# EasyEDA Pro project MN42_v2.eprj, schematic MOAR_Schematic, sheet 4 of 4

## Sheets
4 brain: Create Date: 2026-02-03; Page Name: brain; Update Date: 2026-02-02
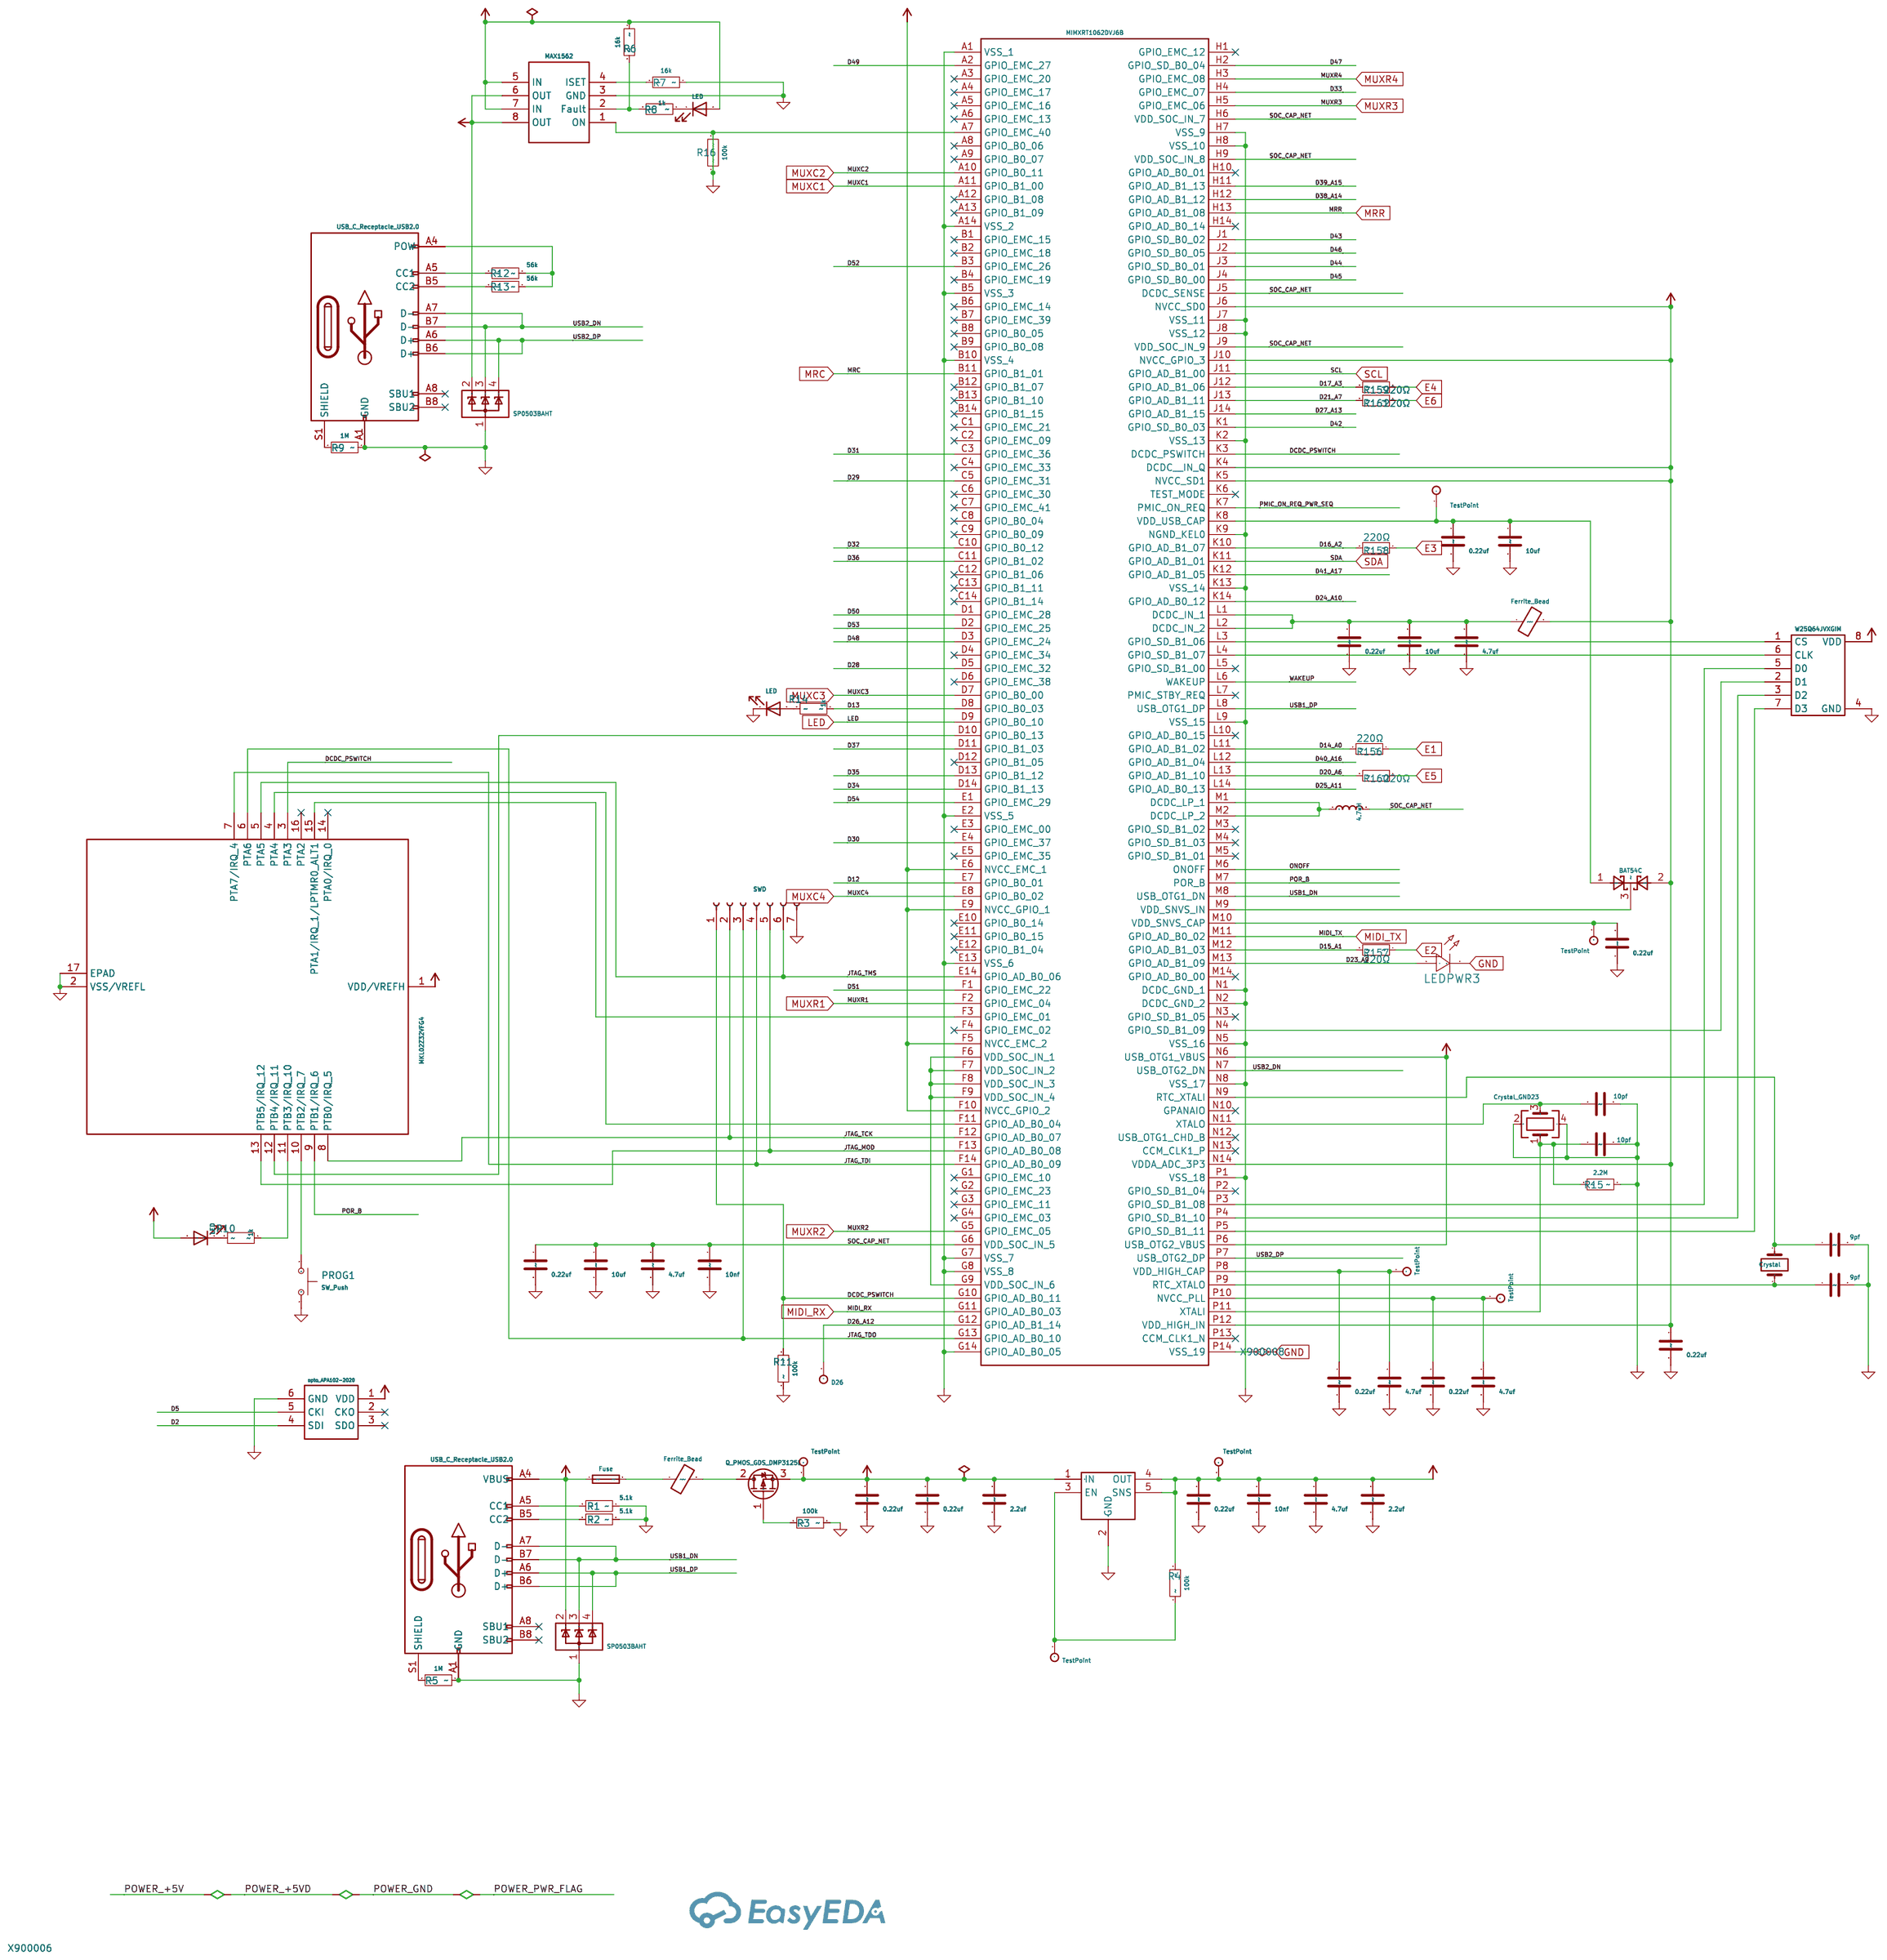
[diagram p3: brain]

## Parts
C1  0.22uf  [Capacitor_SMD:C_0603_1608Metric]
C2  0.22uf  [Capacitor_SMD:C_0603_1608Metric]
C3  2.2uf  [Capacitor_SMD:C_0603_1608Metric]
C4  0.22uf  [Capacitor_SMD:C_0603_1608Metric]
C10  0.22uf  [Capacitor_SMD:C_0603_1608Metric]
C11  10uf  [Capacitor_SMD:C_0805_2012Metric]
C12  4.7uf  [Capacitor_SMD:C_0603_1608Metric]
C13  0.22uf  [Capacitor_SMD:C_0603_1608Metric]
C14  10uf  [Capacitor_SMD:C_0805_2012Metric]
C15  4.7uf  [Capacitor_SMD:C_0603_1608Metric]
C16  10nf  [Capacitor_SMD:C_0603_1608Metric]
C17  0.22uf  [Capacitor_SMD:C_0603_1608Metric]
C18  0.22uf  [Capacitor_SMD:C_0603_1608Metric]
C19  10pf  [Capacitor_SMD:C_0603_1608Metric]
C20  10pf  [Capacitor_SMD:C_0603_1608Metric]
C21  9pf  [Capacitor_SMD:C_0603_1608Metric]
C22  9pf  [Capacitor_SMD:C_0603_1608Metric]
C23  0.22uf  [Capacitor_SMD:C_0603_1608Metric]
C24  4.7uf  [Capacitor_SMD:C_0603_1608Metric]
C25  0.22uf  [Capacitor_SMD:C_0603_1608Metric]
C26  4.7uf  [Capacitor_SMD:C_0603_1608Metric]
C138  2.2uf  [Capacitor_SMD:C_0603_1608Metric]
C139  0.22uf  [Capacitor_SMD:C_0603_1608Metric]
C140  4.7uf  [Capacitor_SMD:C_0603_1608Metric]
C141  10uf  [Capacitor_SMD:C_0805_2012Metric]
C142  10nf  [Capacitor_SMD:C_0603_1608Metric]
D1  SP0503BAHT  [Package_TO_SOT_SMD:SOT-143]
D2  LED  [LED_SMD:LED_0402_1005Metric]
D3  LED  [LED_SMD:LED_0402_1005Metric]
D4  LED  [LED_SMD:LED_0402_1005Metric]
D5  BAT54C  [Package_TO_SOT_SMD:SOT-23]
Di3  SP0503BAHT  [Package_TO_SOT_SMD:SOT-143]
F2  Fuse  [Resistor_SMD:R_0805_2012Metric]
FB1  Ferrite_Bead  [Resistor_SMD:R_0805_2012Metric]
FB2  Ferrite_Bead  [Resistor_SMD:R_0805_2012Metric]
IC1  MIMXRT1062DVJ6B  [MIMXRT1062DVJ6B:BGA196C80P14X14_1200X1200X152]
L1  4.7uH  [Capacitor_SMD:C_0805_2012Metric]
LEDPWR3  -  [LED_0603]
NCP692  OnSemi NCP692, fixed version  [Package_DFN_QFN:DFN-6-1EP_3x3mm_P0.95mm_EP1.7x2.6mm]
P2  D26  [Connector_PinHeader_1.00mm:PinHeader_1x01_P1.00mm_Vertical]
PROG1  SW_Push  [ToyTronics:KMR241GLFS]
Q1  Q_PMOS_GDS_DMP3125L  [Package_TO_SOT_SMD:SOT-23]
R1  5.1k  [Resistor_SMD:R_0603_1608Metric]
R2  5.1k  [Resistor_SMD:R_0603_1608Metric]
R3  100k  [Resistor_SMD:R_0603_1608Metric]
R4  100k  [Resistor_SMD:R_0603_1608Metric]
R5  1M  [Resistor_SMD:R_0603_1608Metric]
R6  16k  [Resistor_SMD:R_0603_1608Metric]
R7  16k  [Resistor_SMD:R_0603_1608Metric]
R8  1k  [Resistor_SMD:R_0402_1005Metric]
R9  1M  [Resistor_SMD:R_0603_1608Metric]
R10  1k  [Resistor_SMD:R_0402_1005Metric]
R11  100k  [Resistor_SMD:R_0603_1608Metric]
R12  56k  [Resistor_SMD:R_0603_1608Metric]
R13  56k  [Resistor_SMD:R_0603_1608Metric]
R14  1k  [Resistor_SMD:R_0402_1005Metric]
R15  2.2M  [Resistor_SMD:R_0603_1608Metric]
R16  100k  [Resistor_SMD:R_0603_1608Metric]
R156  220Ω  [RES-TH_BD1.7-L3.5-P7.50-D0.5]
R157  220Ω  [RES-TH_BD1.7-L3.5-P7.50-D0.5]
R158  220Ω  [RES-TH_BD1.7-L3.5-P7.50-D0.5]
R159  220Ω  [RES-TH_BD1.7-L3.5-P7.50-D0.5]
R160  220Ω  [RES-TH_BD1.7-L3.5-P7.50-D0.5]
R161  220Ω  [RES-TH_BD1.7-L3.5-P7.50-D0.5]
SWD1  SWD  [Connector_PinHeader_1.27mm:PinHeader_1x07_P1.27mm_Vertical]
TP1  TestPoint  [TestPoint:TestPoint_Pad_D1.0mm]
TP2  TestPoint  [TestPoint:TestPoint_Pad_D1.0mm]
TP3  TestPoint  [TestPoint:TestPoint_Pad_D1.0mm]
TP4  TestPoint  [TestPoint:TestPoint_Pad_D1.0mm]
TP5  TestPoint  [TestPoint:TestPoint_Pad_D1.0mm]
TP6  TestPoint  [TestPoint:TestPoint_Pad_D1.0mm]
TP7  TestPoint  [TestPoint:TestPoint_Pad_D1.0mm]
U1  opto_APA102-2020  [USB-C-Power-tester:APA102-2020]
U2  MAX1562  [Package_SO:SO-8_3.9x4.9mm_P1.27mm]
U3  W25Q64JVXGIM  [MIMXRT1062DVJ6B:XSON8_4x4mm]
U4  MKL02Z32VFG4  [Package_DFN_QFN:QFN-16-1EP_3x3mm_P0.5mm_EP1.8x1.8mm]
USB_DFP1  USB_C_Receptacle_USB2.0  [USB-C-Power-tester:TYPE-C-31-M-14]
USB_UFP1  USB_C_Receptacle_USB2.0  [USB-C-Power-tester:TYPE-C-31-M-14]
Y1  Crystal_GND23  [Crystal:Crystal_SMD_Abracon_ABM3B-4Pin_5.0x3.2mm]
Y2  Crystal  [Crystal:Crystal_SMD_2012-2Pin_2.0x1.2mm]

## Library data of the parts
C1 C2 C4 C10 C13 C17 C18 C23 C25 C139 = Device_C: Attribute1: C3; MFGR: Jellybean (X7R or better); MPN: CC0603KRX7R6BB224
C3 = Device_C: MFGR: Jellybean (X7R or better); MPN: CL10B225KP8NNNC
C11 C14 C141 = Device_C: MFGR: Jellybean (X7R or better); MPN: GRM21BR71A106KA73K
C12 C15 C24 C26 C140 = Device_C: Attribute1: C3; MFGR: Jellybean (X7R or better); MPN: CL10B475KQ8NQNC
C16 C142 = Device_C: Attribute1: C3; MFGR: Jellybean (X7R or better); MPN: 0603B103K160CT
C19 C20 = Device_C: Attribute1: C3; MFGR: Jellybean (X7R or better); MPN: CC0603KRNPO9BN100
C21 C22 = Device_C: Attribute1: C3; MFGR: Jellybean (X7R or better); MPN: GRM1885C1H9R0DA01D
C138 = Device_C: Attribute1: C3; MFGR: Jellybean (X7R or better); MPN: CL10B225KP8NNNC
D1 = Power_Protection_SP0503BAHT: Attribute1: Di3; User doc link: http://www.littelfuse.com/~/media/files/littelfuse/technical%20resources/documents/data%20sheets/sp05xxba.pdf
D2 = Device_LED
D3 D4 = Device_LED: Attribute1: D2
D5 = Diode_BAT54C: User doc link: http://www.diodes.com/_files/datasheets/ds11005.pdf
Di3 = Power_Protection_SP0503BAHT: User doc link: http://www.littelfuse.com/~/media/files/littelfuse/technical%20resources/documents/data%20sheets/sp05xxba.pdf
F2 = Device_Fuse: MFGR: Bel Fuse Inc; MPN: 0ZCK0050FF2E
FB1 FB2 = Device_Ferrite_Bead: Attribute1: F1; MFGR: Taiyo Yuden; MPN: FBMH2012HM121-T‎
IC1 = MIMXRT1062DVJ6B_MIMXRT1062DVJ6B: IC MCU 32BIT EXT MEM 196MAPBGA; Height: 1.52; Manufacturer_Name: NXP; Mouser Part Number: 771-MIMXRT1062DVJ6B; Mouser Price/Stock: https://www.mouser.co.uk/ProductDetail/NXP-Semiconductors/MIMXRT1062DVJ6B?qs=BJlw7L4Cy7%252B08A9rbTO5WQ%3D%3D; User doc link: https://www.nxp.com/docs/en/nxp/data-sheets/IMXRT1060CEC.pdf
L1 = Device_L: Attribute1: C14; MFGR: Jellybean (X7R or better); MPN: LQM21PN4R7MGRD
LEDPWR3 = LED_0603-R: Supplier Footprint: 0603
NCP692 = ToyTronics2_OnSemi NCP692, fixed version: MFGR: Onsemi; MPN: NCP692MN33T2G; User doc link: https://www.onsemi.com/pdf/datasheet/ncp690-d.pdf
P2 TP7 = Connector_TestPoint
PROG1 = Switch_SW_Push: Attribute1: *; Attribute2: Copyright 2016 Accelerated Designs. All rights reserved.; Attribute3: *; MFGR: C&K; MPN: KMR241GLFS
Q1 = Device_Q_PMOS_GDS: Attribute1: DMP3125L; Attribute2: Diodes; User doc link: https://www.diodes.com/assets/Datasheets/DMP3125L.pdf
R1 R2 = Device_R: Attribute1: R7; MFGR: Jellybean; MPN: RC0603FR-075K1L
R3-R6 R9 R11-R13 R15 R16 = Device_R: Attribute1: R7; MFGR: Jellybean; MPN: RMCF0603FT56K0
R7 = Device_R: MFGR: Jellybean; MPN: RMCF0603FT56K0
R8 R10 = Device_R: Attribute1: R14
R14 = Device_R
R156-R161 = RN 1/8W 4K7 F T/B A1: Type:Metal Film Resistors Resistance: Tolerance:±1% Tolerance:±1% Overload Voltage (Max):150V Power(Watts):125mW Temperature Coefficient:±50ppm/℃ Temperature Coefficient:±50ppm/℃ Operating Temperature Range:-55℃~+125℃ Operating Temperature Range:-55℃~+125; LCSC Part Name: 4.7kΩ ±1% 125mW 金属膜电阻; Supplier Part: C433477; Manufacturer: Tyohm(幸亚电阻); Supplier Footprint: 插件,D1.7xL3.5mm; JLCPCB Part Class: Extended Part; Datasheet: https://atta.szlcsc.com/upload/public/pdf/source/20191008/C433681_B72693A7FD256E0D1DC5EFE3F095EED3.pdf; Supplier: LCSC; Type: Metal Film Resistors; Tolerance: ±1%; Overload Voltage (Max): 150V; Power(Watts): 125mW; Temperature Coefficient: ±50ppm/℃; Operating Temperature Range: -55℃~+125℃
SWD1 = Connector_Conn_01x07_Female
TP1-TP6 = Connector_TestPoint: Attribute1: TP7
U1 = APA102_opto_APA102-2020
U2 = MIMXRT1062DVJ6B_MAX1562
U3 = MIMXRT1062DVJ6B_W25Q64VXGIM
U4 = MCU_NXP_Kinetis_MKL02Z32VFG4: MFGR: Supplied by Roest Coffee; MPN: Custom firmware part; User doc link: http://www.nxp.com/docs/en/data-sheet/KL02P32M48SF0.pdf
USB_DFP1 = simonsen_USB_C_Receptacle_USB2.0_NOPOW: User doc link: https://www.usb.org/sites/default/files/documents/usb_type-c.zip
USB_UFP1 = Connector_USB_C_Receptacle_USB2.0: User doc link: https://www.usb.org/sites/default/files/documents/usb_type-c.zip
Y1 = Device_Crystal_GND24
Y2 = Device_Crystal: MFGR: Abracon; MPN: ABS06-32.768KHZ-9-1-T

## Nets
GND: C1.1 C1.2 C2.1 C2.2 C3.1 C3.2 C4.2 C10.2 C11.2 C12.2 C13.2 C14.2 C15.2 C16.2 C17.2 C18.2 C19.2 C20.2 C21.2 C22.2 C23.2 C24.2 C25.2 C26.2 C138.2 C139.2 C140.2 C141.2 C142.2 D1.1(A) D1.2(K) D2.2(A) D3.1(K) Di3.1(A) F2.1 IC1.A1(VSS_1) IC1.A7(GPIO_EMC_40) IC1.A14(VSS_2) IC1.B5(VSS_3) IC1.B10(VSS_4) IC1.E2(VSS_5) IC1.E13(VSS_6) IC1.G7(VSS_7) IC1.G8(VSS_8) IC1.G14(GPIO_AD_B0_05) IC1.H7(VSS_9) IC1.H8(VSS_10) IC1.J7(VSS_11) IC1.J8(VSS_12) IC1.K2(VSS_13) IC1.K9(NGND_KEL0) IC1.K13(VSS_14) IC1.L9(VSS_15) IC1.N1(DCDC_GND_1) IC1.N2(DCDC_GND_2) IC1.N5(VSS_16) IC1.N6(USB_OTG1_VBUS) IC1.N8(VSS_17) IC1.P1(VSS_18) IC1.P6(USB_OTG2_VBUS) IC1.P14(VSS_19) LEDPWR3.1(C) NCP692.1(IN) NCP692.2(GND) NCP692.6(IN) NCP692.7(GND) PROG1.2 Q1.3(S) R1.1 R2.1 R3.1 R5.1 R6.1 R7.1 R9.1 R11.1 R15.1 R16.1 R16.2 SWD1.7(Pin) TP1.1 U1.1(VDD) U1.6(GND) U2.1(ON) U2.3(GND) U2.5(IN) U2.7(IN) U3.4(GND) U4.2(VSS/VREFL) U4.17(EPAD) USB_DFP1.A1(GND) USB_DFP1.A12(GND) USB_DFP1.B1(GND) USB_DFP1.B12(GND) USB_UFP1.A1(GND) USB_UFP1.A4(VBUS) USB_UFP1.A9(VBUS) USB_UFP1.A12(GND) USB_UFP1.B1(GND) USB_UFP1.B4(VBUS) USB_UFP1.B9(VBUS) USB_UFP1.B12(GND) Y1.2 Y1.4 ; also on sheet 1 2 3
D2: U1.4(SDI)
D5: U1.5(CKI)
D12: IC1.E7(GPIO_B0_01)
D13: IC1.D8(GPIO_B0_03) R14.1
D14_A0: IC1.L11(GPIO_AD_B1_02) R156.2
D15_A1: IC1.M12(GPIO_AD_B1_03) R157.2
D16_A2: IC1.K10(GPIO_AD_B1_07) R158.2
D17_A3: IC1.J12(GPIO_AD_B1_06) R159.2
D20_A6: IC1.L13(GPIO_AD_B1_10) R160.2
D21_A7: IC1.J13(GPIO_AD_B1_11) R161.2
D23_A9: IC1.M13(GPIO_AD_B1_09) LEDPWR3.2(A)
D24_A10: IC1.K14(GPIO_AD_B0_12)
D25_A11: IC1.L14(GPIO_AD_B0_13)
D26_A12: IC1.G12(GPIO_AD_B1_14) P2.1
D27_A13: IC1.J14(GPIO_AD_B1_15)
D28: IC1.D5(GPIO_EMC_32)
D29: IC1.C5(GPIO_EMC_31)
D30: IC1.E4(GPIO_EMC_37)
D31: IC1.C3(GPIO_EMC_36)
D32: IC1.C10(GPIO_B0_12)
D33: IC1.H4(GPIO_EMC_07)
D34: IC1.D14(GPIO_B1_13)
D35: IC1.D13(GPIO_B1_12)
D36: IC1.C11(GPIO_B1_02)
D37: IC1.D11(GPIO_B1_03)
D38_A14: IC1.H12(GPIO_AD_B1_12)
D39_A15: IC1.H11(GPIO_AD_B1_13)
D40_A16: IC1.L12(GPIO_AD_B1_04)
D41_A17: IC1.K12(GPIO_AD_B1_05)
D42: IC1.K1(GPIO_SD_B0_03)
D43: IC1.J1(GPIO_SD_B0_02)
D44: IC1.J3(GPIO_SD_B0_01)
D45: IC1.J4(GPIO_SD_B0_00)
D46: IC1.J2(GPIO_SD_B0_05)
D47: IC1.H2(GPIO_SD_B0_04)
D48: IC1.D3(GPIO_EMC_24)
D49: IC1.A2(GPIO_EMC_27)
D50: IC1.D1(GPIO_EMC_28)
D51: IC1.F1(GPIO_EMC_22)
D52: IC1.B3(GPIO_EMC_26)
D53: IC1.D2(GPIO_EMC_25)
D54: IC1.E1(GPIO_EMC_29)
DCDC_PSWITCH: IC1.G10(GPIO_AD_B0_11) IC1.K3(DCDC_PSWITCH) R11.2 SWD1.1(Pin) U4.3(PTA3)
E1: R156.1 ; also on sheet 3
E2: R157.1 ; also on sheet 3
E3: R158.1 ; also on sheet 3
E4: R159.1 ; also on sheet 3
E5: R160.1 ; also on sheet 3
E6: R161.1 ; also on sheet 3
JTAG_MOD: IC1.F13(GPIO_AD_B0_08) SWD1.5(Pin) U4.13(PTB5/IRQ_12)
JTAG_TCK: IC1.F12(GPIO_AD_B0_07) SWD1.2(Pin) U4.8(PTB0/IRQ_5)
JTAG_TDI: IC1.F14(GPIO_AD_B0_09) SWD1.4(Pin) U4.7(PTA7/IRQ_4)
JTAG_TDO: IC1.G13(GPIO_AD_B0_10) SWD1.3(Pin) U4.6(PTA6)
JTAG_TMS: IC1.E14(GPIO_AD_B0_06) SWD1.6(Pin) U4.5(PTA5)
LED: IC1.D9(GPIO_B0_10) ; also on sheet 1
MIDI_RX: IC1.G11(GPIO_AD_B0_03) ; also on sheet 2
MIDI_TX: IC1.M11(GPIO_AD_B0_02) ; also on sheet 1
MRC: IC1.B11(GPIO_B1_01) ; also on sheet 2
MRR: IC1.H13(GPIO_AD_B1_08) ; also on sheet 2
MUXC1: IC1.A11(GPIO_B1_00) ; also on sheet 2
MUXC2: IC1.A10(GPIO_B0_11) ; also on sheet 2
MUXC3: IC1.D7(GPIO_B0_00) ; also on sheet 2
MUXC4: IC1.E8(GPIO_B0_02) ; also on sheet 2
MUXR1: IC1.F2(GPIO_EMC_04) ; also on sheet 2
MUXR2: IC1.G5(GPIO_EMC_05) ; also on sheet 2
MUXR3: IC1.H5(GPIO_EMC_06) ; also on sheet 2
MUXR4: IC1.H3(GPIO_EMC_08) ; also on sheet 2
ONOFF: IC1.M6(ONOFF)
PMIC_ON_REQ_PWR_SEQ: IC1.K7(PMIC_ON_REQ)
POR_B: IC1.M7(POR_B) U4.9(PTB1/IRQ_6)
POWER_+3V3: C4.1 C17.1 C138.1 C140.1 C142.1 D4.2(A) D5.2 FB2.2 IC1.E6(NVCC_EMC_1) IC1.E9(NVCC_GPIO_1) IC1.F5(NVCC_EMC_2) IC1.F10(NVCC_GPIO_2) IC1.J6(NVCC_SD0) IC1.J10(NVCC_GPIO_3) IC1.K4(DCDC__IN_Q) IC1.K5(NVCC_SD1) IC1.N14(VDDA_ADC_3P3) IC1.P12(VDD_HIGH_IN) NCP692.4(OUT) NCP692.5(SNS) R4.2 TP2.1 U3.8(VDD) U4.1(VDD/VREFH)
POWER_+5VL: Di3.2(K) R12.1 R13.1 U2.6(OUT) U2.8(OUT) USB_DFP1.A4(POW) USB_DFP1.A9(POW) USB_DFP1.B4(POW) USB_DFP1.B9(POW)
SCL: IC1.J11(GPIO_AD_B1_00) ; also on sheet 2
SDA: IC1.K11(GPIO_AD_B1_01) ; also on sheet 2
SOC_CAP_NET: C13.1 C14.1 C15.1 C16.1 IC1.F6(VDD_SOC_IN_1) IC1.F7(VDD_SOC_IN_2) IC1.F8(VDD_SOC_IN_3) IC1.F9(VDD_SOC_IN_4) IC1.G6(VDD_SOC_IN_5) IC1.G9(VDD_SOC_IN_6) IC1.H6(VDD_SOC_IN_7) IC1.H9(VDD_SOC_IN_8) IC1.J5(DCDC_SENSE) IC1.J9(VDD_SOC_IN_9) L1.2
USB1_DN: D1.3(K) IC1.M8(USB_OTG1_DN) USB_UFP1.A7(D-) USB_UFP1.B7(D-)
USB1_DP: D1.4(K) IC1.L8(USB_OTG1_DP) USB_UFP1.A6(D+) USB_UFP1.B6(D+)
USB2_DN: Di3.3(K) IC1.N7(USB_OTG2_DN) USB_DFP1.A7(D-) USB_DFP1.B7(D-)
USB2_DP: Di3.4(K) IC1.P7(USB_OTG2_DP) USB_DFP1.A6(D+) USB_DFP1.B6(D+)
WAKEUP: IC1.L6(WAKEUP)
$6N5535: C21.1 IC1.N9(RTC_XTALI) Y2.2
$6N5646: R7.2 U2.4(ISET)
$6N5676: C22.1 IC1.P9(RTC_XTALO) Y2.1
$6N5679: C18.1 IC1.M10(VDD_SNVS_CAP) TP5.1
$6N5765: D5.3 IC1.M9(VDD_SNVS_IN)
$6N5769: IC1.M1(DCDC_LP_1) IC1.M2(DCDC_LP_2) L1.1
$6N5807: C23.1 C24.1 IC1.P8(VDD_HIGH_CAP) TP6.1
$6N5837: C25.1 C26.1 IC1.P10(NVCC_PLL) TP7.1
$6N5896: IC1.F11(GPIO_AD_B0_04) U4.4(PTA4)
$6N5905: C20.1 IC1.P11(XTALI) R15.2 Y1.1
$6N5925: IC1.L3(GPIO_SD_B1_06) U3.1(CS)
$6N5931: R6.2 R8.2 U2.2(Fault)
$6N5960: IC1.P3(GPIO_SD_B1_08) U3.5(D0)
$6N5964: R2.2 USB_UFP1.B5(CC2)
$6N5970: R1.2 USB_UFP1.A5(CC1)
$6N5980: PROG1.1 U4.10(PTB2/IRQ_7)
$6N5994: IC1.D10(GPIO_B0_13) U4.12(PTB4/IRQ_11)
$6N5999: R13.2 USB_DFP1.B5(CC2)
$6N6017: C19.1 IC1.N11(XTALO) Y1.3
$6N6028: R12.2 USB_DFP1.A5(CC1)
$6N6030: R10.1 U4.11(PTB3/IRQ_10)
$6N6166: IC1.P4(GPIO_SD_B1_10) U3.3(D2)
$6N6178: Q1.1(G) R3.2
$6N6213: F2.2 FB1.1
$6N6227: FB1.2 Q1.2(D)
$6N6237: C10.1 C11.1 C12.1 FB2.1 IC1.L1(DCDC_IN_1) IC1.L2(DCDC_IN_2)
$6N6263: IC1.N4(GPIO_SD_B1_09) U3.2(D1)
$6N6295: C139.1 C141.1 D5.1 IC1.K8(VDD_USB_CAP) TP4.1
$6N6325: IC1.F3(GPIO_EMC_01) U4.15(PTA1/IRQ_1/LPTMR0_ALT1)
$6N6382: IC1.P5(GPIO_SD_B1_11) U3.7(D3)
$6N6386: IC1.L4(GPIO_SD_B1_07) U3.6(CLK)
$6N6474: D3.2(A) R14.2
$6N6476: D4.1(K) R10.2
$6N6480: R5.2 USB_UFP1.S1(SHIELD)
$6N6490: D2.1(K) R8.1
$6N6502: R9.2 USB_DFP1.S1(SHIELD)
Net-(NCP692-3): NCP692.3(EN) R4.1 TP3.1

Not connected (* = marked no-connect by the designer): IC1 A3(GPIO_EMC_20)* A4(GPIO_EMC_17)* A5(GPIO_EMC_16)* A6(GPIO_EMC_13)* A8(GPIO_B0_06)* A9(GPIO_B0_07)* A12(GPIO_B1_08)* A13(GPIO_B1_09)* B1(GPIO_EMC_15)* B2(GPIO_EMC_18)* B4(GPIO_EMC_19)* B6(GPIO_EMC_14)* B7(GPIO_EMC_39)* B8(GPIO_B0_05)* B9(GPIO_B0_08)* B12(GPIO_B1_07)* B13(GPIO_B1_10)* B14(GPIO_B1_15)* C1(GPIO_EMC_21)* C2(GPIO_EMC_09)* C4(GPIO_EMC_33)* C6(GPIO_EMC_30)* C7(GPIO_EMC_41)* C8(GPIO_B0_04)* C9(GPIO_B0_09)* C12(GPIO_B1_06)* C13(GPIO_B1_11)* C14(GPIO_B1_14)* D4(GPIO_EMC_34)* D6(GPIO_EMC_38)* D12(GPIO_B1_05)* E3(GPIO_EMC_00)* E5(GPIO_EMC_35)* E10(GPIO_B0_14)* E11(GPIO_B0_15)* E12(GPIO_B1_04)* F4(GPIO_EMC_02)* G1(GPIO_EMC_10)* G2(GPIO_EMC_23)* G3(GPIO_EMC_11)* G4(GPIO_EMC_03)* H1(GPIO_EMC_12)* H10(GPIO_AD_B0_01)* H14(GPIO_AD_B0_14)* K6(TEST_MODE)* L5(GPIO_SD_B1_00)* L7(PMIC_STBY_REQ)* L10(GPIO_AD_B0_15)* M3(GPIO_SD_B1_02)* M4(GPIO_SD_B1_03)* M5(GPIO_SD_B1_01)* M14(GPIO_AD_B0_00)* N3(GPIO_SD_B1_05)* N10(GPANAIO)* N12(USB_OTG1_CHD_B)* N13(CCM_CLK1_P)* P2(GPIO_SD_B1_04)* P13(CCM_CLK1_N)*; U1 2(CKO)* 3(SDO)*; U4 14(PTA0/IRQ_0)* 16(PTA2)*; USB_DFP1 A8(SBU1)* B8(SBU2)*; USB_UFP1 A8(SBU1)* B8(SBU2)*
